# EAGLE design avr-arm-jtag-adaptor (EAGLE 5.12)
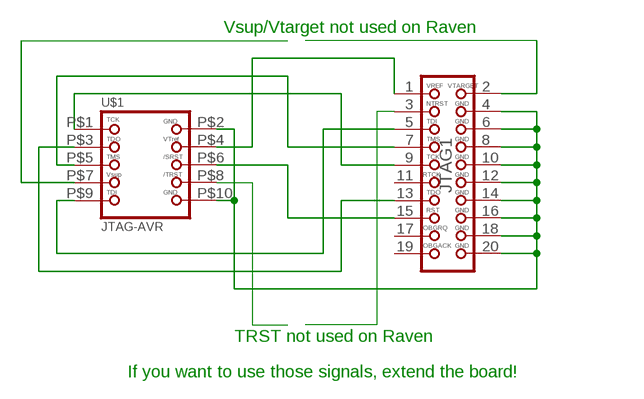
[diagram p0: schematic, sheet 1]

## Parts
JTAG1  JTAG-ARM  [JTAG-ARM]
U$1  JTAG-AVR  [2X10-50MIL-JTAG]

## Nets
GND: JTAG1.4 JTAG1.6 JTAG1.8 JTAG1.10 JTAG1.12 JTAG1.14 JTAG1.16 JTAG1.18 JTAG1.20 U$1.P$2 U$1.P$10
N$1: U$1.P$8
N$2: JTAG1.2
N$3: JTAG1.3
SRST: JTAG1.15 U$1.P$6
TCK: JTAG1.9 U$1.P$1
TDI: JTAG1.5 U$1.P$9
TDO: JTAG1.13 U$1.P$3
TMS: JTAG1.7 U$1.P$5
VREF: JTAG1.1 U$1.P$4
VTARGET: U$1.P$7
Unconnected: JTAG1.11 JTAG1.17 JTAG1.19

## Notes on the sheet
- Vsup/Vtarget not used on Raven
- TRST not used on Raven
- If you want to use those signals, extend the board!

## Library data of the parts
JTAG1 = karlnet-parts:JTAG-ARM: 20 Pin JTAG Connector For use with ARM7, and ARM9. Supported by some Cortex M3 boards with SWJ-DP interfaces (dual SWP/JTAG support). 4UConnector: 03556
U$1 = karlnet-parts:JTAG-AVR

## Board
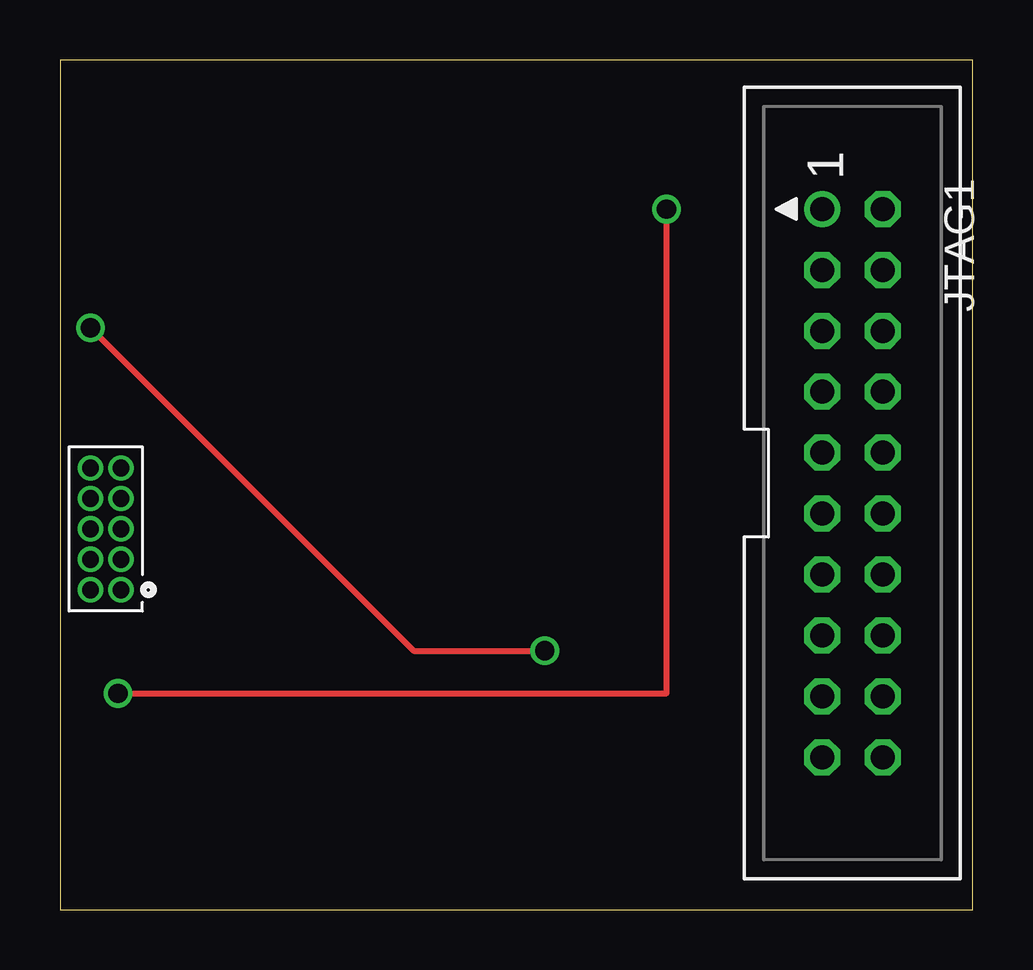
[diagram p1: board, top side]
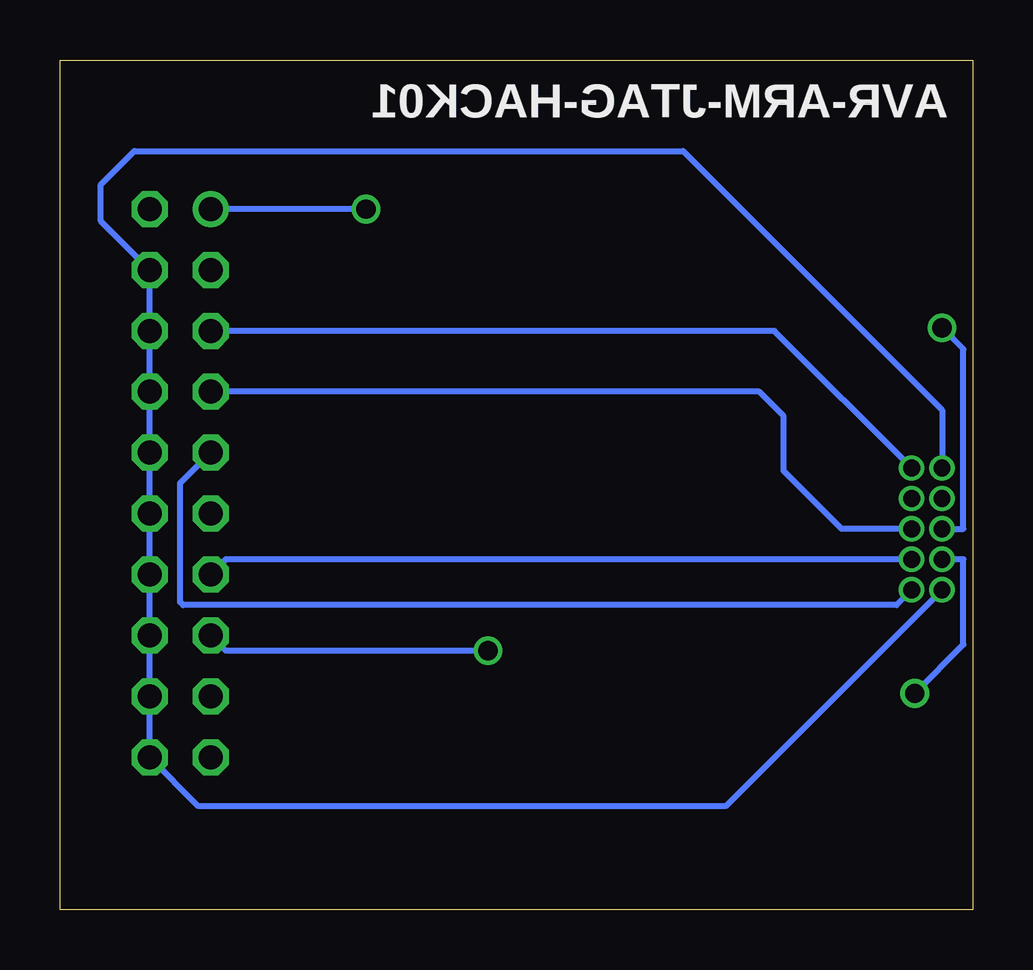
[diagram p2: board, bottom side, seen from below]

Size 38.02 x 35.42 mm. Coordinates in mm from the lower left corner, seen from the top.
Outline: 0,0 38.02,0 38.02,35.42 0,35.42 0,0
Copper layers (1*16): Top 0.0356mm / dielectric 1.5011mm / Bottom 0.0356mm
Design rules "dorkbot__LaenPCBOrder": minimum track width 6mil, minimum drill 13mil, track to track 6mil, track to pad 6mil, pad to pad 6mil, via to via 6mil, smd to smd 6mil, copper to edge 15mil, drill to drill 6mil, minimum pad ring 7mil, minimum via ring 7mil, stop-mask expansion 4mil, vias tented up to drill 0mil, thermal gap 10mil

### Footprints (pad centres in the part's own frame; a part is rotated, then mirrored left to right if it is on the bottom)
JTAG-ARM = drill 1 round: 1 -11.43,-1.27 | drill 1 octagon: 2 -11.43,1.27; 3 -8.89,-1.27; 4 -8.89,1.27; 5 -6.35,-1.27; 6 -6.35,1.27; 7 -3.81,-1.27; 8 -3.81,1.27; 9 -1.27,-1.27; 10 -1.27,1.27; 11 1.27,-1.27; 12 1.27,1.27; 13 3.81,-1.27; 14 3.81,1.27; 15 6.35,-1.27; 16 6.35,1.27; 17 8.89,-1.27; 18 8.89,1.27; 19 11.43,-1.27; 20 11.43,1.27
2X10-50MIL-JTAG = drill 0.7 pad 1 round: P$1 0,0; P$2 0,1.27; P$3 1.27,0; P$4 1.27,1.27; P$5 2.54,0; P$6 2.54,1.27; P$7 3.81,0; P$8 3.81,1.27; P$9 5.08,0; P$10 5.08,1.27

### Placement (x,y rotation side)
JTAG1  33.02,17.78 270 top
U$1  2.54,13.34 90 top

### Tracks (layer width: path | path; a pad name or v marks a point on that pad's centre or on a via)
GND
  Bottom 0.254: U$1.P$2 10.29,4.32 32.26,4.32 JTAG1.20 JTAG1.18 JTAG1.16 JTAG1.14 JTAG1.12 JTAG1.10 JTAG1.8 JTAG1.6 JTAG1.4 36.32,28.7 36.32,30.23 34.92,31.62 12.06,31.62 1.27,20.83 U$1.P$10
SRST  (via drill 0.8)
  Top 0.254: v1.27,24.26 14.73,10.79 v20.19,10.79
  Bottom 0.254: v20.19,10.79 31.11,10.79 JTAG1.15 | v1.27,24.26 0.38,23.37 0.38,15.88 U$1.P$6
TCK
  Bottom 0.254: JTAG1.9 33.02,17.78 33.02,12.83 32.89,12.7 3.17,12.7 U$1.P$1
TDI
  Bottom 0.254: JTAG1.5 8.26,24.13 U$1.P$9
TDO
  Bottom 0.254: JTAG1.13 31.11,14.61 U$1.P$3
TMS
  Bottom 0.254: JTAG1.7 8.89,21.59 7.87,20.57 7.87,18.29 5.46,15.88 U$1.P$5
VREF  (via drill 0.8)
  Top 0.254: v25.27,29.21 25.27,9.02 v2.41,9.02
  Bottom 0.254: v25.27,29.21 JTAG1.1 | v2.41,9.02 0.38,11.05 0.38,14.61 U$1.P$4

### Text on the board
bPlace: AVR-ARM-JTAG-HACK01